# Altium schematic sheet COR_Balance.SchDoc
size A1; SheetNumber: 1; SheetTotal: 1
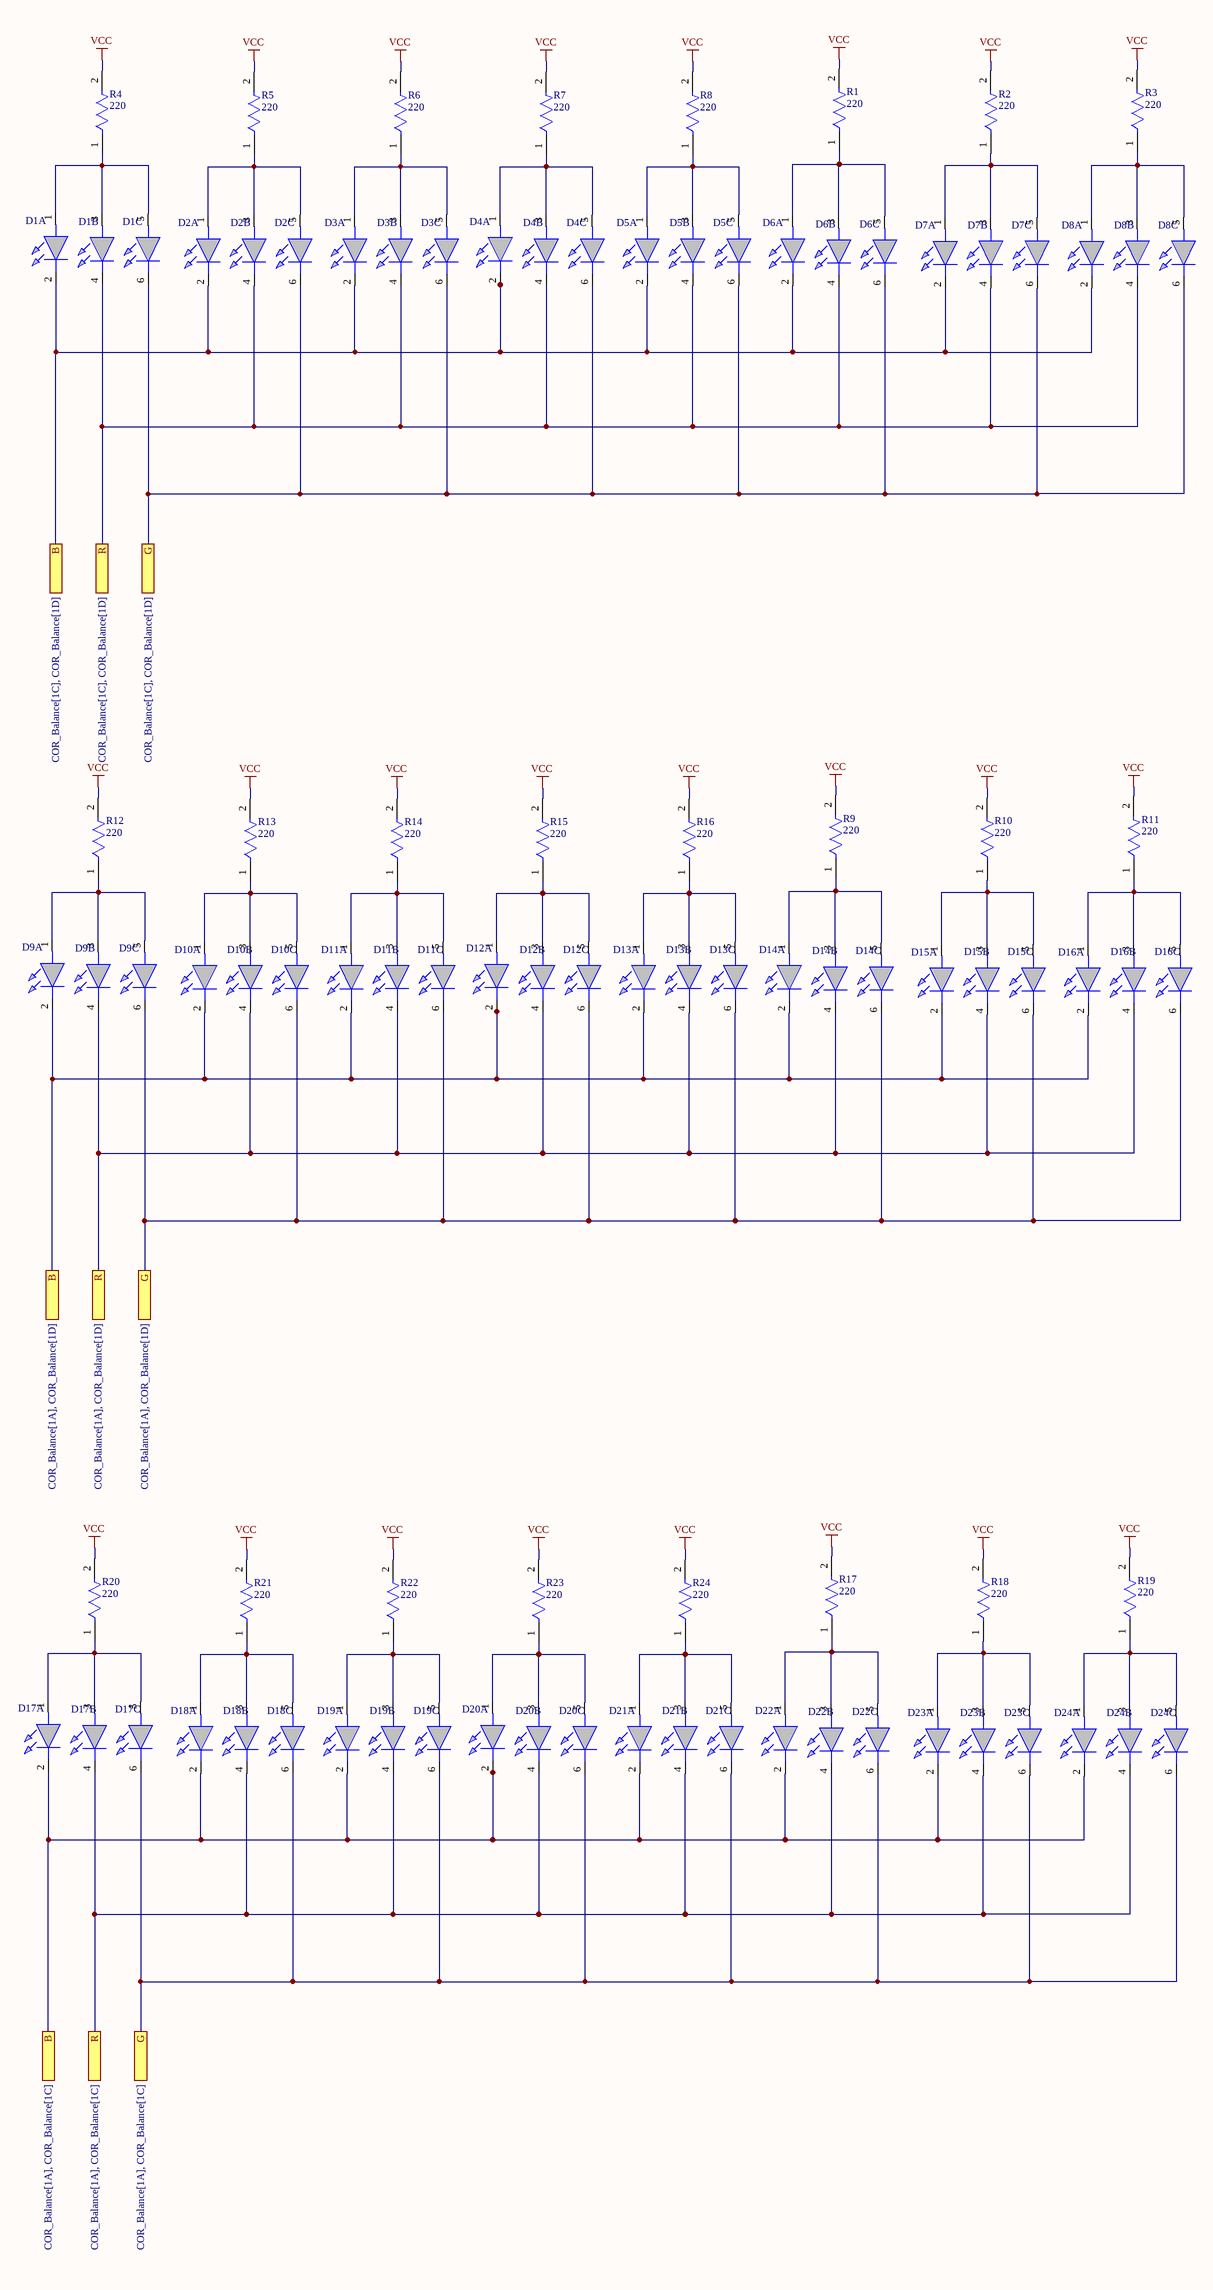
[diagram p0: COR_Balance.SchDoc]

## Parts
D1  LED_RGB  [RGB_LED_5x5]  (value not drawn)  (parts A,B,C of 3)
D2  LED_RGB  [RGB_LED_5x5]  (value not drawn)  (parts A,B,C of 3)
D3  LED_RGB  [RGB_LED_5x5]  (value not drawn)  (parts A,B,C of 3)
D4  LED_RGB  [RGB_LED_5x5]  (value not drawn)  (parts A,B,C of 3)
D5  LED_RGB  [RGB_LED_5x5]  (value not drawn)  (parts A,B,C of 3)
D6  LED_RGB  [RGB_LED_5x5]  (value not drawn)  (parts A,B,C of 3)
D7  LED_RGB  [RGB_LED_5x5]  (value not drawn)  (parts A,B,C of 3)
D8  LED_RGB  [RGB_LED_5x5]  (value not drawn)  (parts A,B,C of 3)
D9  LED_RGB  [RGB_LED_5x5]  (value not drawn)  (parts A,B,C of 3)
D10  LED_RGB  [RGB_LED_5x5]  (value not drawn)  (parts A,B,C of 3)
D11  LED_RGB  [RGB_LED_5x5]  (value not drawn)  (parts A,B,C of 3)
D12  LED_RGB  [RGB_LED_5x5]  (value not drawn)  (parts A,B,C of 3)
D13  LED_RGB  [RGB_LED_5x5]  (value not drawn)  (parts A,B,C of 3)
D14  LED_RGB  [RGB_LED_5x5]  (value not drawn)  (parts A,B,C of 3)
D15  LED_RGB  [RGB_LED_5x5]  (value not drawn)  (parts A,B,C of 3)
D16  LED_RGB  [RGB_LED_5x5]  (value not drawn)  (parts A,B,C of 3)
D17  LED_RGB  [RGB_LED_5x5]  (value not drawn)  (parts A,B,C of 3)
D18  LED_RGB  [RGB_LED_5x5]  (value not drawn)  (parts A,B,C of 3)
D19  LED_RGB  [RGB_LED_5x5]  (value not drawn)  (parts A,B,C of 3)
D20  LED_RGB  [RGB_LED_5x5]  (value not drawn)  (parts A,B,C of 3)
D21  LED_RGB  [RGB_LED_5x5]  (value not drawn)  (parts A,B,C of 3)
D22  LED_RGB  [RGB_LED_5x5]  (value not drawn)  (parts A,B,C of 3)
D23  LED_RGB  [RGB_LED_5x5]  (value not drawn)  (parts A,B,C of 3)
D24  LED_RGB  [RGB_LED_5x5]  (value not drawn)  (parts A,B,C of 3)
R1  220  [RES-0805]
R2  220  [RES-0805]
R3  220  [RES-0805]
R4  220  [RES-0805]
R5  220  [RES-0805]
R6  220  [RES-0805]
R7  220  [RES-0805]
R8  220  [RES-0805]
R9  220  [RES-0805]
R10  220  [RES-0805]
R11  220  [RES-0805]
R12  220  [RES-0805]
R13  220  [RES-0805]
R14  220  [RES-0805]
R15  220  [RES-0805]
R16  220  [RES-0805]
R17  220  [RES-0805]
R18  220  [RES-0805]
R19  220  [RES-0805]
R20  220  [RES-0805]
R21  220  [RES-0805]
R22  220  [RES-0805]
R23  220  [RES-0805]
R24  220  [RES-0805]

## Ports
B (see COR_Balance[1A], COR_Balance[1C]), B (see COR_Balance[1A], COR_Balance[1D]), B (see COR_Balance[1C], COR_Balance[1D]), G (see COR_Balance[1A], COR_Balance[1C]), G (see COR_Balance[1A], COR_Balance[1D]), G (see COR_Balance[1C], COR_Balance[1D]), R (see COR_Balance[1A], COR_Balance[1C]), R (see COR_Balance[1A], COR_Balance[1D]), R (see COR_Balance[1C], COR_Balance[1D])

## Nets
VCC: R1.2 R2.2 R3.2 R4.2 R5.2 R6.2 R7.2 R8.2 R9.2 R10.2 R11.2 R12.2 R13.2 R14.2 R15.2 R16.2 R17.2 R18.2 R19.2 R20.2 R21.2 R22.2 R23.2 R24.2
B: D1.2(K) D2.2(K) D3.2(K) D4.2(K) D5.2(K) D6.2(K) D7.2(K) D8.2(K) D9.2(K) D10.2(K) D11.2(K) D12.2(K) D13.2(K) D14.2(K) D15.2(K) D16.2(K) D17.2(K) D18.2(K) D19.2(K) D20.2(K) D21.2(K) D22.2(K) D23.2(K) D24.2(K) ; port B
G: D1.6(K) D2.6(K) D3.6(K) D4.6(K) D5.6(K) D6.6(K) D7.6(K) D8.6(K) D9.6(K) D10.6(K) D11.6(K) D12.6(K) D13.6(K) D14.6(K) D15.6(K) D16.6(K) D17.6(K) D18.6(K) D19.6(K) D20.6(K) D21.6(K) D22.6(K) D23.6(K) D24.6(K) ; port G
R: D1.4(K) D2.4(K) D3.4(K) D4.4(K) D5.4(K) D6.4(K) D7.4(K) D8.4(K) D9.4(K) D10.4(K) D11.4(K) D12.4(K) D13.4(K) D14.4(K) D15.4(K) D16.4(K) D17.4(K) D18.4(K) D19.4(K) D20.4(K) D21.4(K) D22.4(K) D23.4(K) D24.4(K) ; port R
NetD1_1: D1.1(A) D1.3(A) D1.5(A) R4.1
NetD2_1: D2.1(A) D2.3(A) D2.5(A) R5.1
NetD3_1: D3.1(A) D3.3(A) D3.5(A) R6.1
NetD4_1: D4.1(A) D4.3(A) D4.5(A) R7.1
NetD5_1: D5.1(A) D5.3(A) D5.5(A) R8.1
NetD6_1: D6.1(A) D6.3(A) D6.5(A) R1.1
NetD7_1: D7.1(A) D7.3(A) D7.5(A) R2.1
NetD8_1: D8.1(A) D8.3(A) D8.5(A) R3.1
NetD9_1: D9.1(A) D9.3(A) D9.5(A) R12.1
NetD10_1: D10.1(A) D10.3(A) D10.5(A) R13.1
NetD11_1: D11.1(A) D11.3(A) D11.5(A) R14.1
NetD12_1: D12.1(A) D12.3(A) D12.5(A) R15.1
NetD13_1: D13.1(A) D13.3(A) D13.5(A) R16.1
NetD14_1: D14.1(A) D14.3(A) D14.5(A) R9.1
NetD15_1: D15.1(A) D15.3(A) D15.5(A) R10.1
NetD16_1: D16.1(A) D16.3(A) D16.5(A) R11.1
NetD17_1: D17.1(A) D17.3(A) D17.5(A) R20.1
NetD18_1: D18.1(A) D18.3(A) D18.5(A) R21.1
NetD19_1: D19.1(A) D19.3(A) D19.5(A) R22.1
NetD20_1: D20.1(A) D20.3(A) D20.5(A) R23.1
NetD21_1: D21.1(A) D21.3(A) D21.5(A) R24.1
NetD22_1: D22.1(A) D22.3(A) D22.5(A) R17.1
NetD23_1: D23.1(A) D23.3(A) D23.5(A) R18.1
NetD24_1: D24.1(A) D24.3(A) D24.5(A) R19.1

## Library data of the parts
R1-R24 = RES-CONST